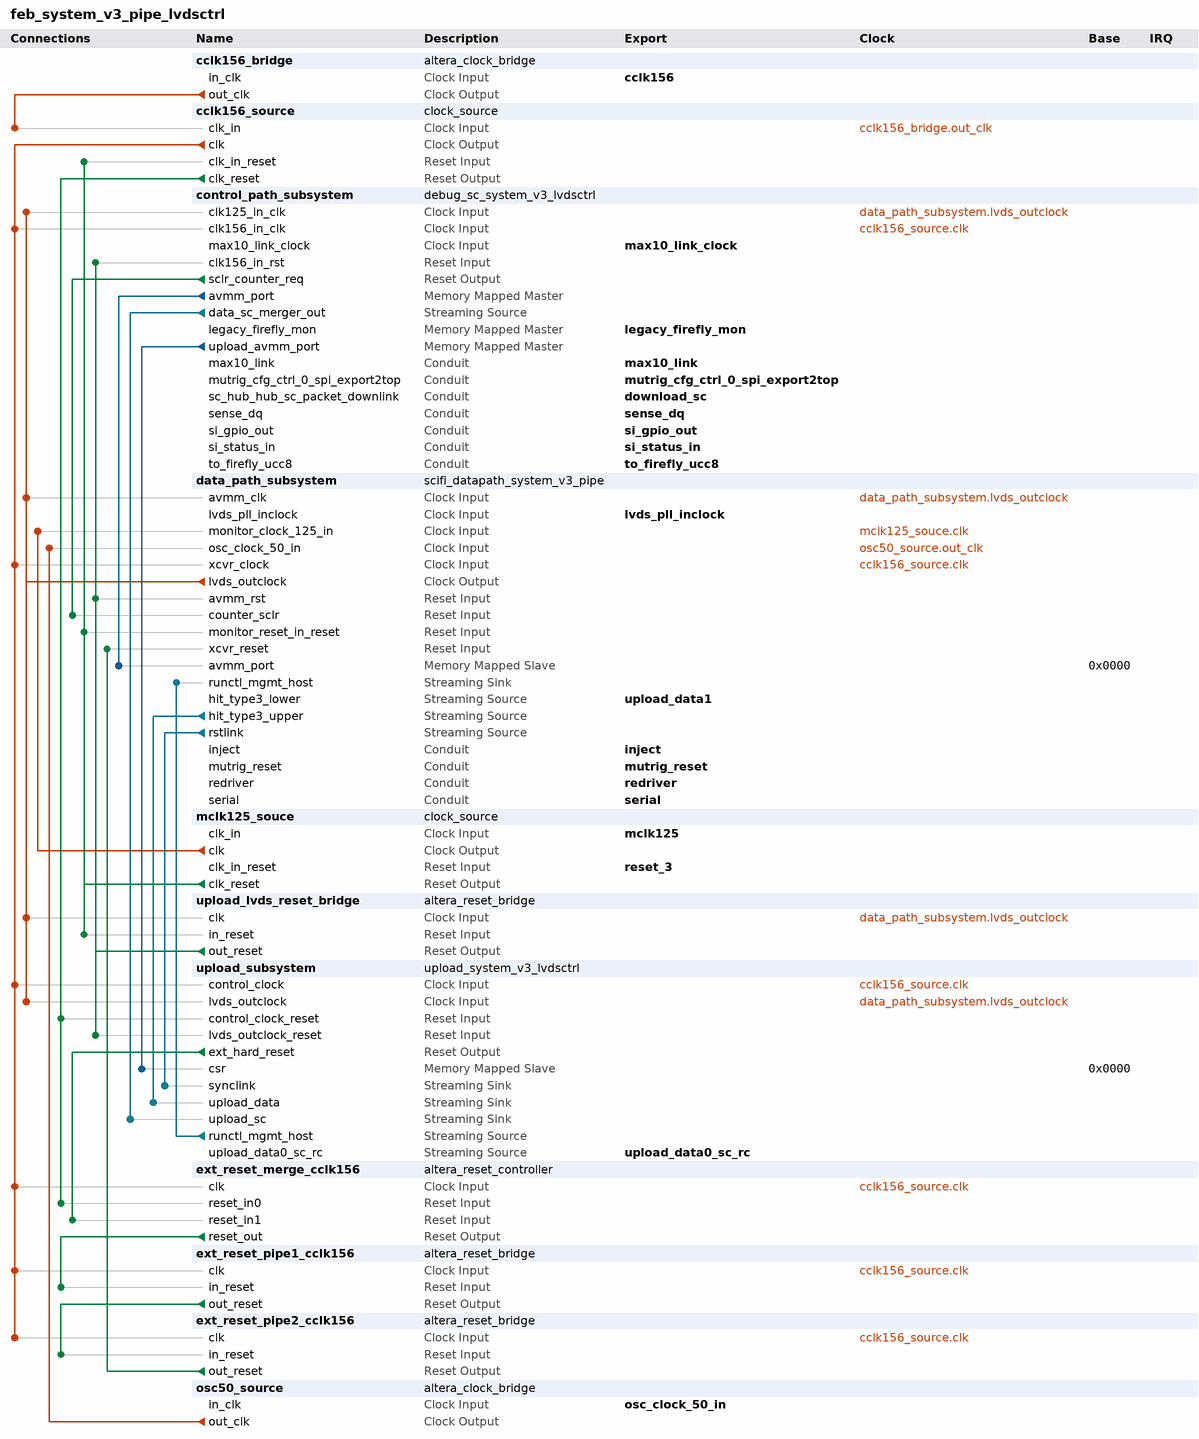
[diagram p0: system contents]
# Platform Designer (Qsys) system feb_system_v3_pipe_lvdsctrl, Arria V 5AGXBA7D4F31C5
# Parameters at their usual value, and those the tool derives, are not listed.
package require -exact qsys 18.1
create_system feb_system_v3_pipe_lvdsctrl
set_project_property DEVICE_FAMILY {Arria V}
set_project_property DEVICE 5AGXBA7D4F31C5

add_instance cclk156_bridge altera_clock_bridge 18.1
set_instance_parameter_value cclk156_bridge DERIVED_CLOCK_RATE 0
set_instance_parameter_value cclk156_bridge EXPLICIT_CLOCK_RATE 156250000

add_instance cclk156_source clock_source 18.1
set_instance_parameter_value cclk156_source clockFrequency 156250000
set_instance_parameter_value cclk156_source resetSynchronousEdges DEASSERT

add_instance control_path_subsystem debug_sc_system_v3_lvdsctrl 1.0

add_instance data_path_subsystem scifi_datapath_system_v3_pipe 1.0

add_instance mclk125_souce clock_source 18.1
set_instance_parameter_value mclk125_souce clockFrequency 125000000
set_instance_parameter_value mclk125_souce resetSynchronousEdges DEASSERT

add_instance upload_lvds_reset_bridge altera_reset_bridge 18.1
set_instance_parameter_value upload_lvds_reset_bridge ACTIVE_LOW_RESET 0
set_instance_parameter_value upload_lvds_reset_bridge SYNCHRONOUS_EDGES deassert

add_instance upload_subsystem upload_system_v3_lvdsctrl 1.0

add_instance ext_reset_merge_cclk156 altera_reset_controller 18.1
set_instance_parameter_value ext_reset_merge_cclk156 NUM_RESET_INPUTS 2
set_instance_parameter_value ext_reset_merge_cclk156 SYNC_DEPTH 3

add_instance ext_reset_pipe1_cclk156 altera_reset_bridge 18.1
set_instance_parameter_value ext_reset_pipe1_cclk156 ACTIVE_LOW_RESET 0
set_instance_parameter_value ext_reset_pipe1_cclk156 SYNCHRONOUS_EDGES deassert

add_instance ext_reset_pipe2_cclk156 altera_reset_bridge 18.1
set_instance_parameter_value ext_reset_pipe2_cclk156 ACTIVE_LOW_RESET 0
set_instance_parameter_value ext_reset_pipe2_cclk156 SYNCHRONOUS_EDGES deassert

add_instance osc50_source altera_clock_bridge 18.1
set_instance_parameter_value osc50_source DERIVED_CLOCK_RATE 0
set_instance_parameter_value osc50_source EXPLICIT_CLOCK_RATE 50000000

# connections
add_connection cclk156_bridge.out_clk cclk156_source.clk_in clock
add_connection cclk156_source.clk control_path_subsystem.clk156_in_clk clock
add_connection cclk156_source.clk data_path_subsystem.xcvr_clock clock
add_connection cclk156_source.clk ext_reset_merge_cclk156.clk clock
add_connection cclk156_source.clk ext_reset_pipe1_cclk156.clk clock
add_connection cclk156_source.clk ext_reset_pipe2_cclk156.clk clock
add_connection cclk156_source.clk upload_subsystem.control_clock clock
add_connection data_path_subsystem.lvds_outclock control_path_subsystem.clk125_in_clk clock
add_connection data_path_subsystem.lvds_outclock data_path_subsystem.avmm_clk clock
add_connection data_path_subsystem.lvds_outclock upload_lvds_reset_bridge.clk clock
add_connection data_path_subsystem.lvds_outclock upload_subsystem.lvds_outclock clock
add_connection mclk125_souce.clk data_path_subsystem.monitor_clock_125_in clock
add_connection osc50_source.out_clk data_path_subsystem.osc_clock_50_in clock
add_connection cclk156_source.clk_reset ext_reset_merge_cclk156.reset_in0 reset
add_connection cclk156_source.clk_reset upload_subsystem.control_clock_reset reset
add_connection control_path_subsystem.sclr_counter_req data_path_subsystem.counter_sclr reset
add_connection ext_reset_merge_cclk156.reset_out ext_reset_pipe1_cclk156.in_reset reset
add_connection ext_reset_pipe1_cclk156.out_reset ext_reset_pipe2_cclk156.in_reset reset
add_connection ext_reset_pipe2_cclk156.out_reset data_path_subsystem.xcvr_reset reset
add_connection mclk125_souce.clk_reset cclk156_source.clk_in_reset reset
add_connection mclk125_souce.clk_reset data_path_subsystem.monitor_reset_in_reset reset
add_connection mclk125_souce.clk_reset upload_lvds_reset_bridge.in_reset reset
add_connection upload_lvds_reset_bridge.out_reset control_path_subsystem.clk156_in_rst reset
add_connection upload_lvds_reset_bridge.out_reset data_path_subsystem.avmm_rst reset
add_connection upload_lvds_reset_bridge.out_reset upload_subsystem.lvds_outclock_reset reset
add_connection upload_subsystem.ext_hard_reset ext_reset_merge_cclk156.reset_in1 reset
add_connection control_path_subsystem.avmm_port data_path_subsystem.avmm_port avalon
set_connection_parameter_value control_path_subsystem.avmm_port/data_path_subsystem.avmm_port baseAddress 0x0000
add_connection control_path_subsystem.upload_avmm_port upload_subsystem.csr avalon
set_connection_parameter_value control_path_subsystem.upload_avmm_port/upload_subsystem.csr baseAddress 0x0000
add_connection control_path_subsystem.data_sc_merger_out upload_subsystem.upload_sc avalon_streaming
add_connection data_path_subsystem.hit_type3_upper upload_subsystem.upload_data avalon_streaming
add_connection data_path_subsystem.rstlink upload_subsystem.synclink avalon_streaming
add_connection upload_subsystem.runctl_mgmt_host data_path_subsystem.runctl_mgmt_host avalon_streaming

# exported interfaces
add_interface cclk156 clock sink
set_interface_property cclk156 EXPORT_OF cclk156_bridge.in_clk
add_interface download_sc conduit end
set_interface_property download_sc EXPORT_OF control_path_subsystem.sc_hub_hub_sc_packet_downlink
add_interface inject conduit end
set_interface_property inject EXPORT_OF data_path_subsystem.inject
add_interface lvds_pll_inclock clock sink
set_interface_property lvds_pll_inclock EXPORT_OF data_path_subsystem.lvds_pll_inclock
add_interface max10_link conduit end
set_interface_property max10_link EXPORT_OF control_path_subsystem.max10_link
add_interface max10_link_clock clock sink
set_interface_property max10_link_clock EXPORT_OF control_path_subsystem.max10_link_clock
add_interface mclk125 clock sink
set_interface_property mclk125 EXPORT_OF mclk125_souce.clk_in
add_interface mutrig_cfg_ctrl_0_spi_export2top conduit end
set_interface_property mutrig_cfg_ctrl_0_spi_export2top EXPORT_OF control_path_subsystem.mutrig_cfg_ctrl_0_spi_export2top
add_interface mutrig_reset conduit end
set_interface_property mutrig_reset EXPORT_OF data_path_subsystem.mutrig_reset
add_interface legacy_firefly_mon avalon master
set_interface_property legacy_firefly_mon EXPORT_OF control_path_subsystem.legacy_firefly_mon
add_interface osc_clock_50_in clock sink
set_interface_property osc_clock_50_in EXPORT_OF osc50_source.in_clk
add_interface redriver conduit end
set_interface_property redriver EXPORT_OF data_path_subsystem.redriver
add_interface reset_3 reset sink
set_interface_property reset_3 EXPORT_OF mclk125_souce.clk_in_reset
add_interface sense_dq conduit end
set_interface_property sense_dq EXPORT_OF control_path_subsystem.sense_dq
add_interface si_gpio_out conduit end
set_interface_property si_gpio_out EXPORT_OF control_path_subsystem.si_gpio_out
add_interface si_status_in conduit end
set_interface_property si_status_in EXPORT_OF control_path_subsystem.si_status_in
add_interface serial conduit end
set_interface_property serial EXPORT_OF data_path_subsystem.serial
add_interface to_firefly_ucc8 conduit end
set_interface_property to_firefly_ucc8 EXPORT_OF control_path_subsystem.to_firefly_ucc8
add_interface upload_data0_sc_rc avalon_streaming source
set_interface_property upload_data0_sc_rc EXPORT_OF upload_subsystem.upload_data0_sc_rc
add_interface upload_data1 avalon_streaming source
set_interface_property upload_data1 EXPORT_OF data_path_subsystem.hit_type3_lower

set_interconnect_requirement {$system} qsys_mm.clockCrossingAdapter AUTO
set_interconnect_requirement {$system} qsys_mm.enableEccProtection FALSE
set_interconnect_requirement {$system} qsys_mm.insertDefaultSlave FALSE
set_interconnect_requirement {$system} qsys_mm.maxAdditionalLatency 1

save_system feb_system_v3_pipe_lvdsctrl.qsys
